# EAGLE schematic M7102 (EAGLE 6.6.0)

## Sheet 1 of 10
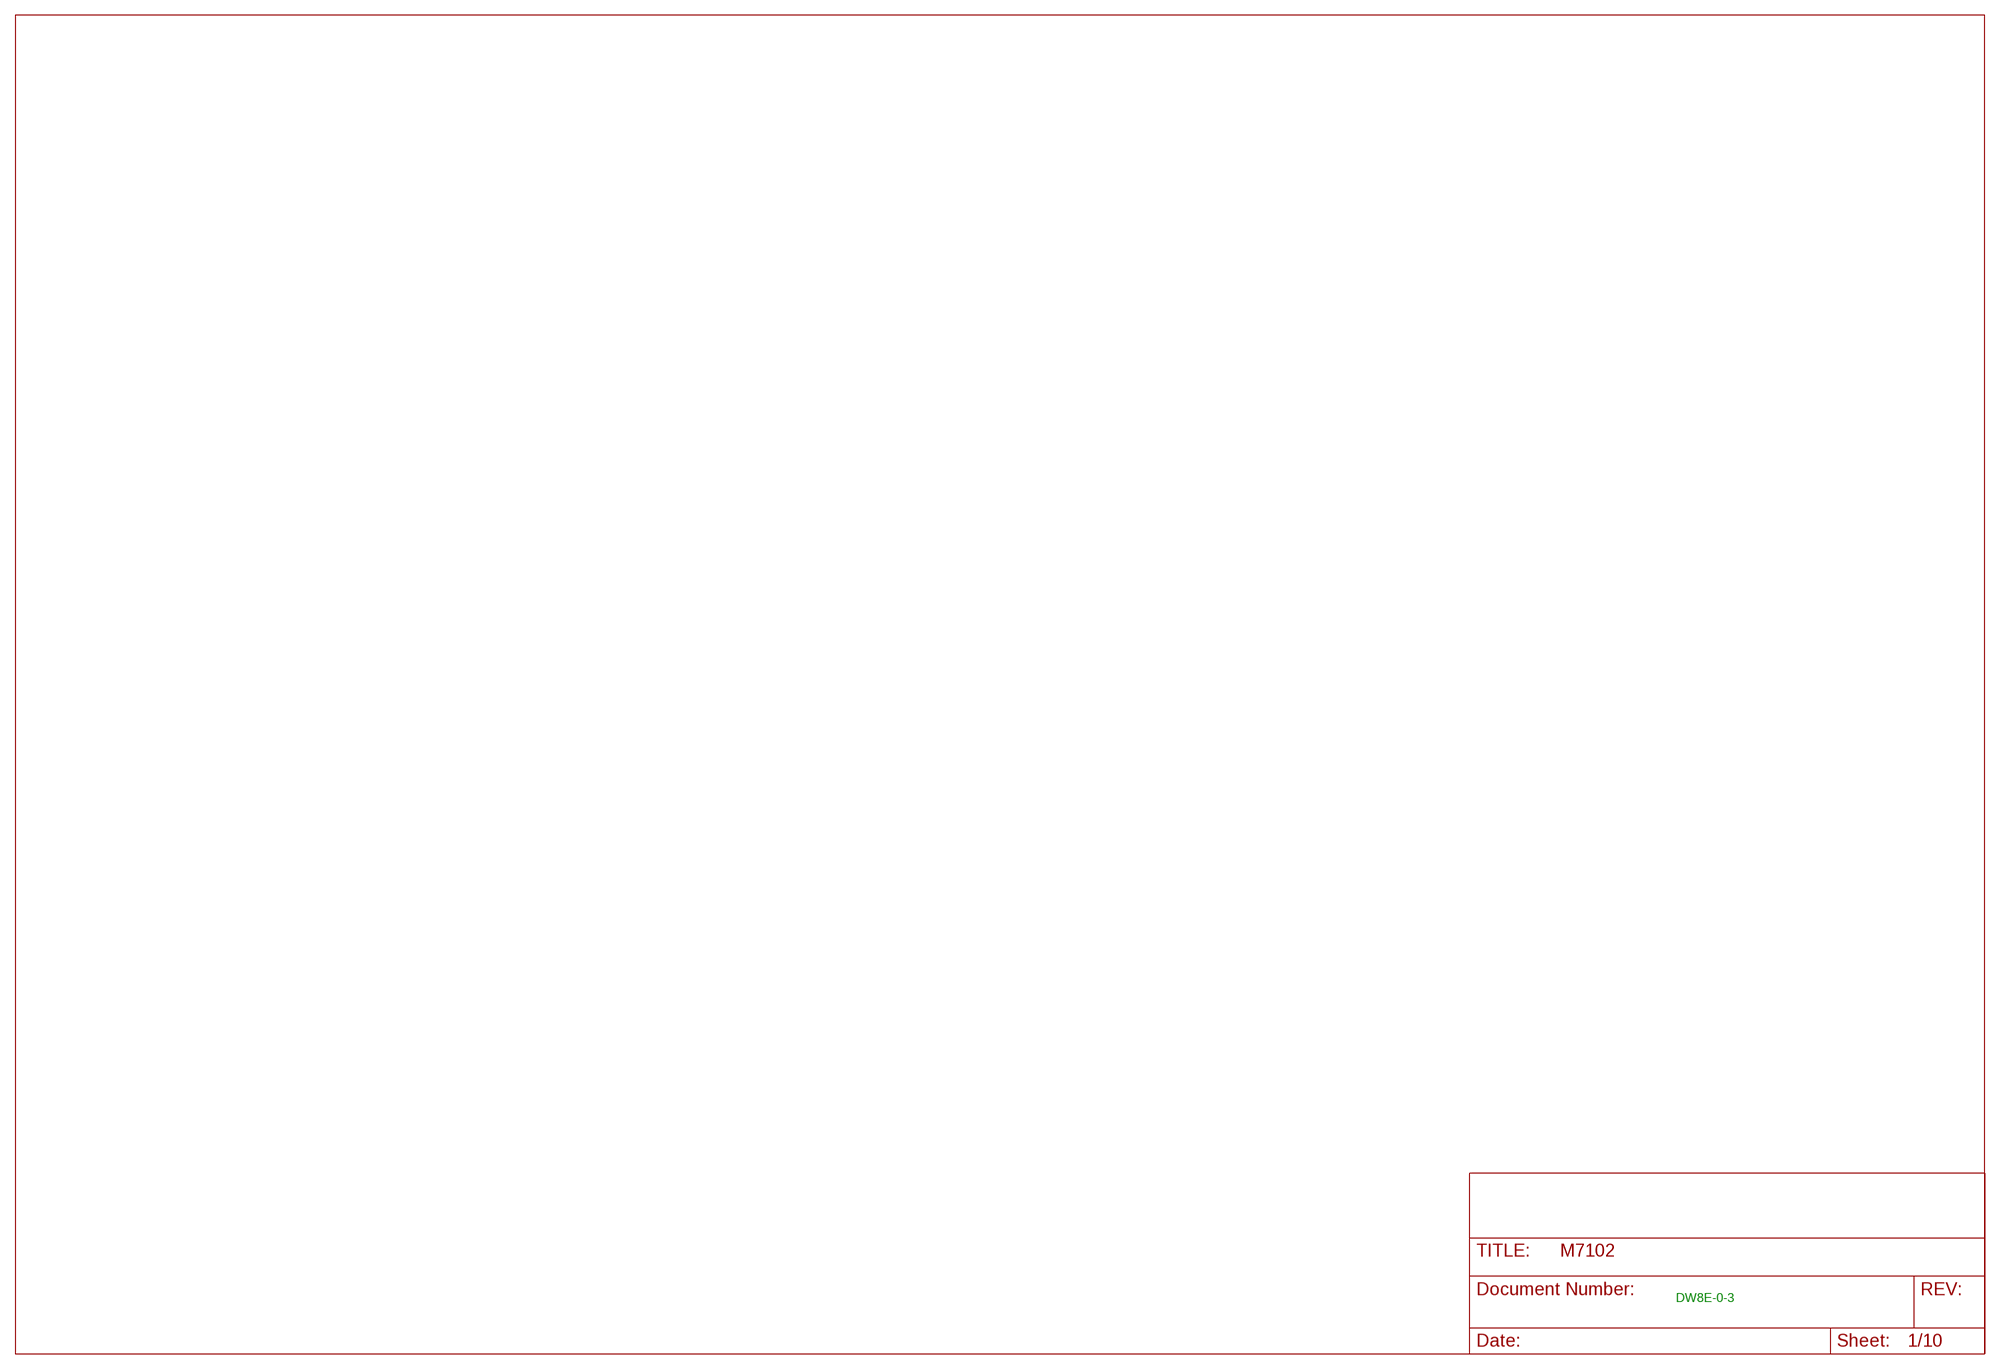
[diagram p0: schematic, sheet 1]

### Notes on the sheet
- DW8E-0-3

## Sheet 2 of 10
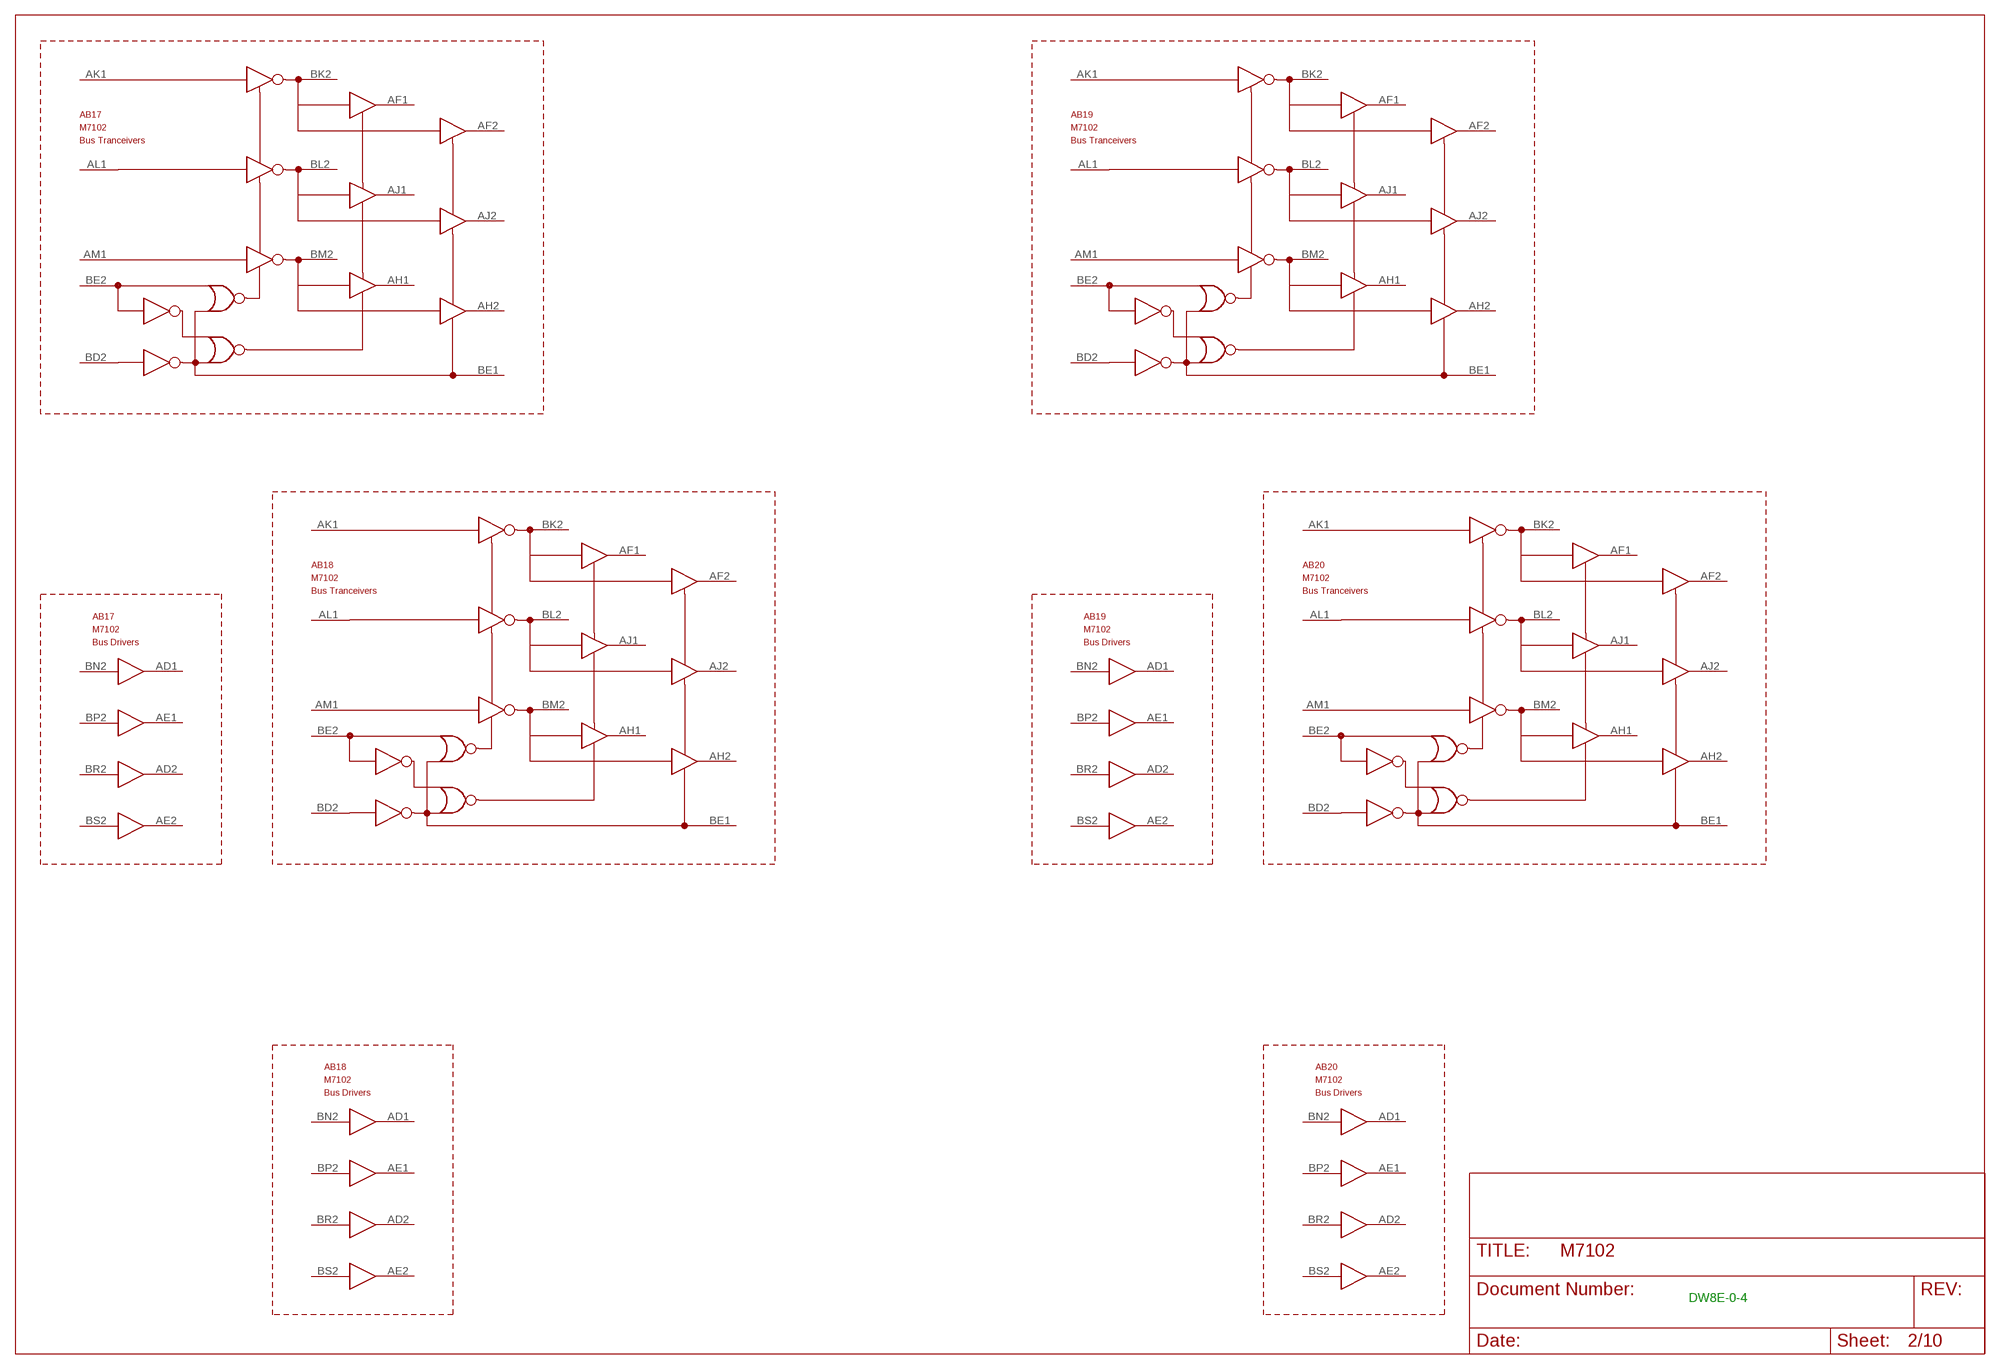
[diagram p1: schematic, sheet 2]

### Parts
AB17  M7102  [H807-2]
AB18  M7102  [H807-2]
AB19  M7102  [H807-2]
AB20  M7102  [H807-2]
Unconnected: AB17.AA1 AB17.AB1 AB17.AD1 AB17.AD2 AB17.AE1 AB17.AE2 AB17.AF1 AB17.AF2 AB17.AH1 AB17.AH2 AB17.AJ1 AB17.AJ2 AB17.AK1 AB17.AL1 AB17.AM1 AB17.AU1 AB17.AV1 AB17.BC1 AB17.BD1 AB17.BD2 AB17.BE1 AB17.BE2 AB17.BK2 AB17.BL2 AB17.BM2 AB17.BN2 AB17.BP2 AB17.BR2 AB17.BS2 AB17.BU1 AB17.BU2 AB17.BV1 AB17.BV2 AB18.AA1 AB18.AB1 AB18.AD1 AB18.AD2 AB18.AE1 AB18.AE2 AB18.AF1 AB18.AF2 AB18.AH1 AB18.AH2 AB18.AJ1 AB18.AJ2 AB18.AK1 AB18.AL1 AB18.AM1 AB18.AU1 AB18.AV1 AB18.BC1 AB18.BD1 AB18.BD2 AB18.BE1 AB18.BE2 AB18.BK2 AB18.BL2 AB18.BM2 AB18.BN2 AB18.BP2 AB18.BR2 AB18.BS2 AB18.BU1 AB18.BU2 AB18.BV1 AB18.BV2 AB19.AA1 AB19.AB1 AB19.AD1 AB19.AD2 AB19.AE1 AB19.AE2 AB19.AF1 AB19.AF2 AB19.AH1 AB19.AH2 AB19.AJ1 AB19.AJ2 AB19.AK1 AB19.AL1 AB19.AM1 AB19.AU1 AB19.AV1 AB19.BC1 AB19.BD1 AB19.BD2 AB19.BE1 AB19.BE2 AB19.BK2 AB19.BL2 AB19.BM2 AB19.BN2 AB19.BP2 AB19.BR2 AB19.BS2 AB19.BU1 AB19.BU2 AB19.BV1 AB19.BV2 AB20.AA1 AB20.AB1 AB20.AD1 AB20.AD2 AB20.AE1 AB20.AE2 AB20.AF1 AB20.AF2 AB20.AH1 AB20.AH2 AB20.AJ1 AB20.AJ2 AB20.AK1 AB20.AL1 AB20.AM1 AB20.AU1 AB20.AV1 AB20.BC1 AB20.BD1 AB20.BD2 AB20.BE1 AB20.BE2 AB20.BK2 AB20.BL2 AB20.BM2 AB20.BN2 AB20.BP2 AB20.BR2 AB20.BS2 AB20.BU1 AB20.BU2 AB20.BV1 AB20.BV2

### Notes on the sheet
- DW8E-0-4

## Sheet 3 of 10
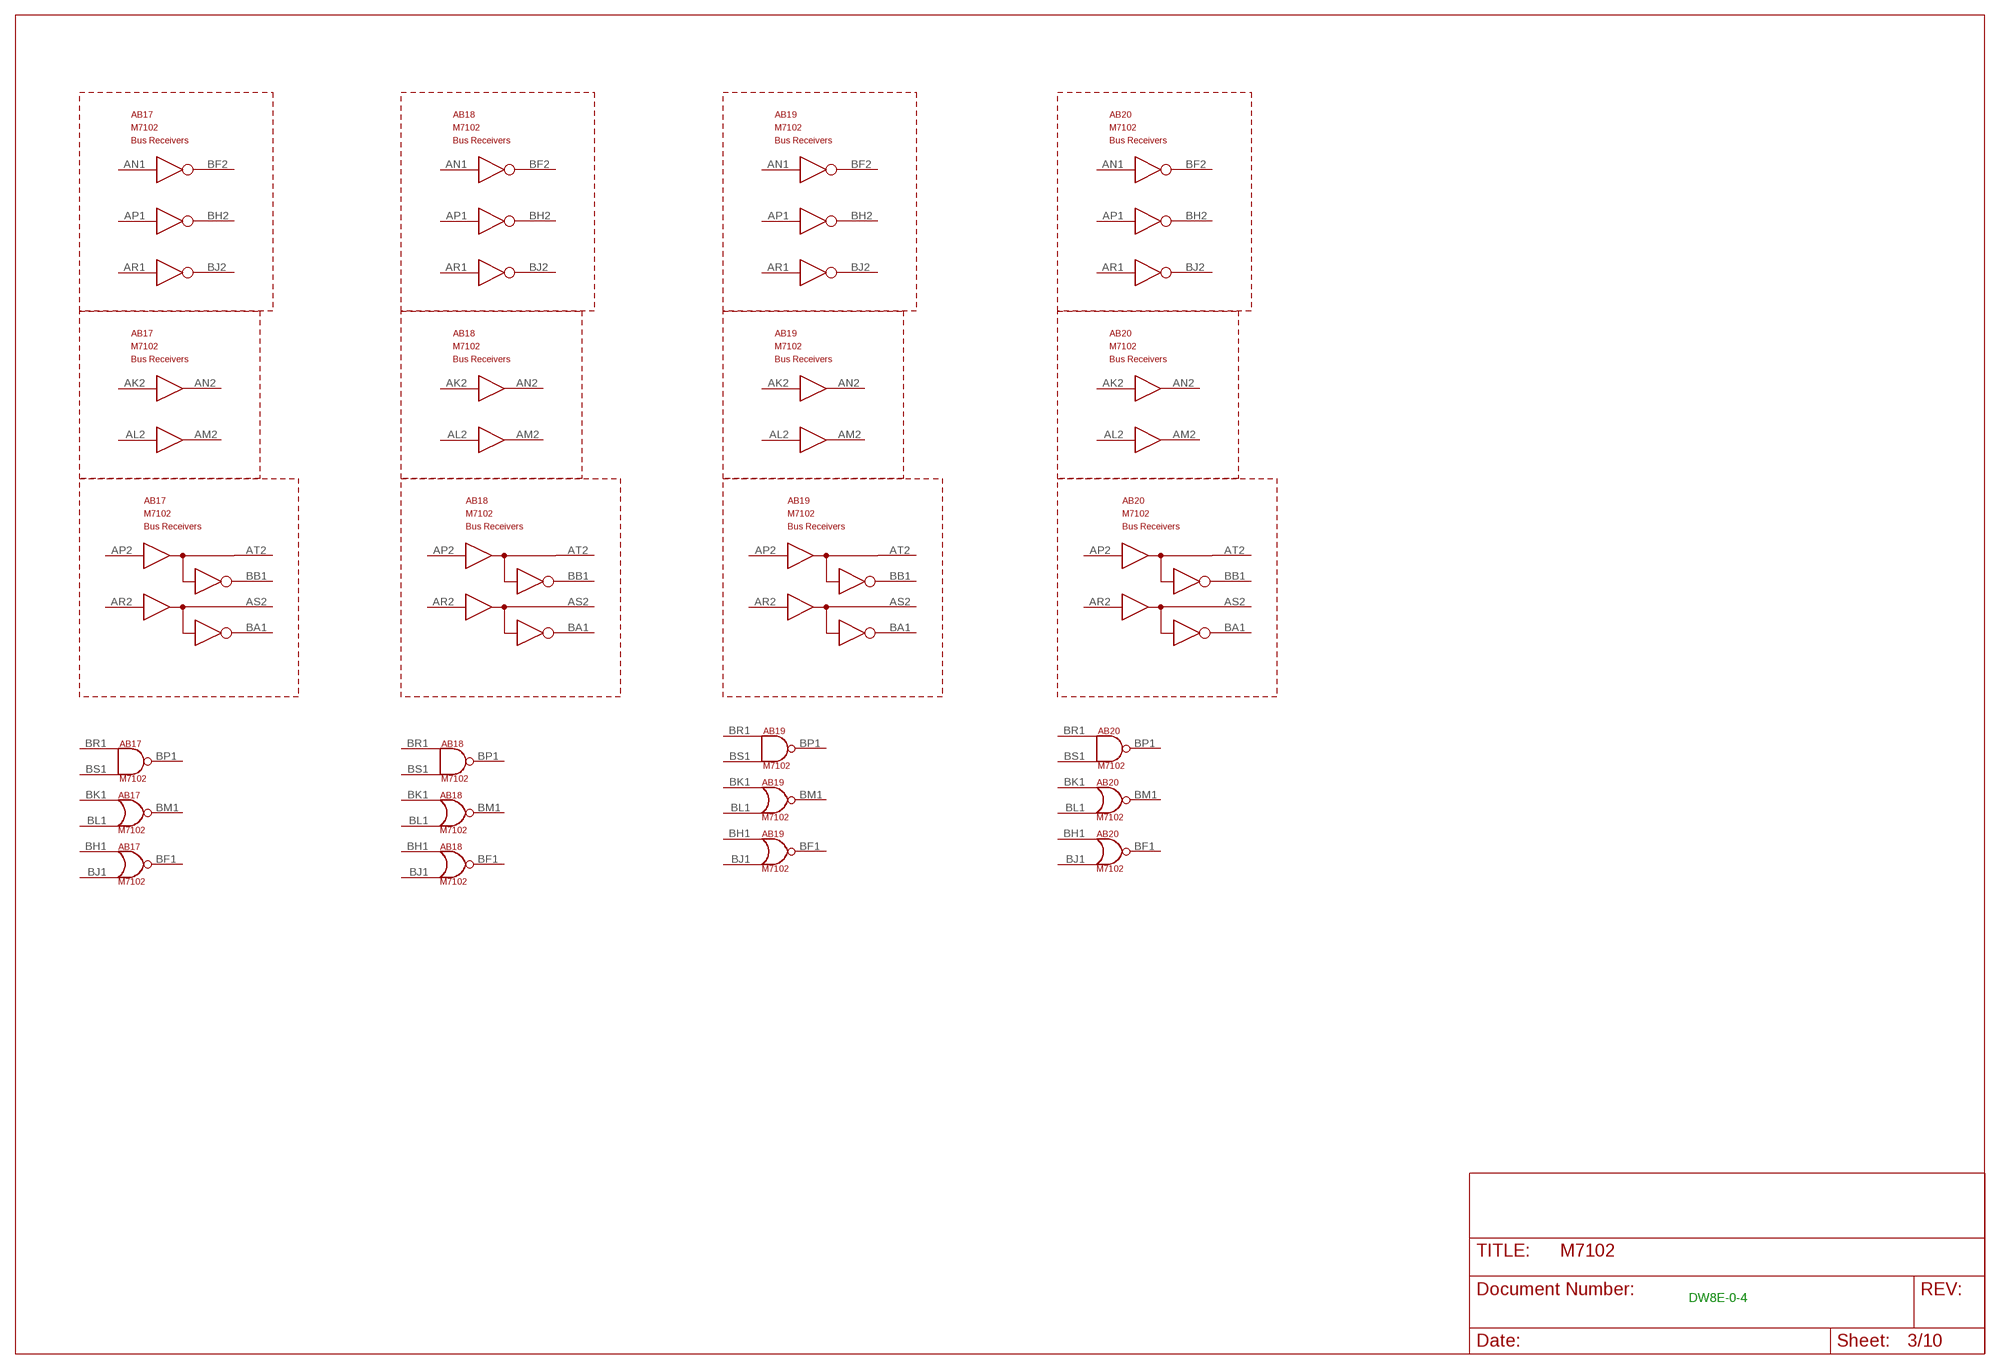
[diagram p2: schematic, sheet 3]
Unconnected: AB17.AK2 AB17.AL2 AB17.AM2 AB17.AN1 AB17.AN2 AB17.AP1 AB17.AP2 AB17.AR1 AB17.AR2 AB17.AS2 AB17.AT2 AB17.BA1 AB17.BB1 AB17.BF1(NOR2:OUT) AB17.BF2 AB17.BH1(NOR2:IN1) AB17.BH2 AB17.BJ1(NOR2:IN2) AB17.BJ2 AB17.BK1(NOR1:IN1) AB17.BL1(NOR1:IN2) AB17.BM1(NOR1:OUT) AB17.BP1(NAND:OUT) AB17.BR1(NAND:IN1) AB17.BS1(NAND:IN2) AB18.AK2 AB18.AL2 AB18.AM2 AB18.AN1 AB18.AN2 AB18.AP1 AB18.AP2 AB18.AR1 AB18.AR2 AB18.AS2 AB18.AT2 AB18.BA1 AB18.BB1 AB18.BF1(NOR2:OUT) AB18.BF2 AB18.BH1(NOR2:IN1) AB18.BH2 AB18.BJ1(NOR2:IN2) AB18.BJ2 AB18.BK1(NOR1:IN1) AB18.BL1(NOR1:IN2) AB18.BM1(NOR1:OUT) AB18.BP1(NAND:OUT) AB18.BR1(NAND:IN1) AB18.BS1(NAND:IN2) AB19.AK2 AB19.AL2 AB19.AM2 AB19.AN1 AB19.AN2 AB19.AP1 AB19.AP2 AB19.AR1 AB19.AR2 AB19.AS2 AB19.AT2 AB19.BA1 AB19.BB1 AB19.BF1(NOR2:OUT) AB19.BF2 AB19.BH1(NOR2:IN1) AB19.BH2 AB19.BJ1(NOR2:IN2) AB19.BJ2 AB19.BK1(NOR1:IN1) AB19.BL1(NOR1:IN2) AB19.BM1(NOR1:OUT) AB19.BP1(NAND:OUT) AB19.BR1(NAND:IN1) AB19.BS1(NAND:IN2) AB20.AK2 AB20.AL2 AB20.AM2 AB20.AN1 AB20.AN2 AB20.AP1 AB20.AP2 AB20.AR1 AB20.AR2 AB20.AS2 AB20.AT2 AB20.BA1 AB20.BB1 AB20.BF1(NOR2:OUT) AB20.BF2 AB20.BH1(NOR2:IN1) AB20.BH2 AB20.BJ1(NOR2:IN2) AB20.BJ2 AB20.BK1(NOR1:IN1) AB20.BL1(NOR1:IN2) AB20.BM1(NOR1:OUT) AB20.BP1(NAND:OUT) AB20.BR1(NAND:IN1) AB20.BS1(NAND:IN2)

### Notes on the sheet
- DW8E-0-4

## Sheet 4 of 10
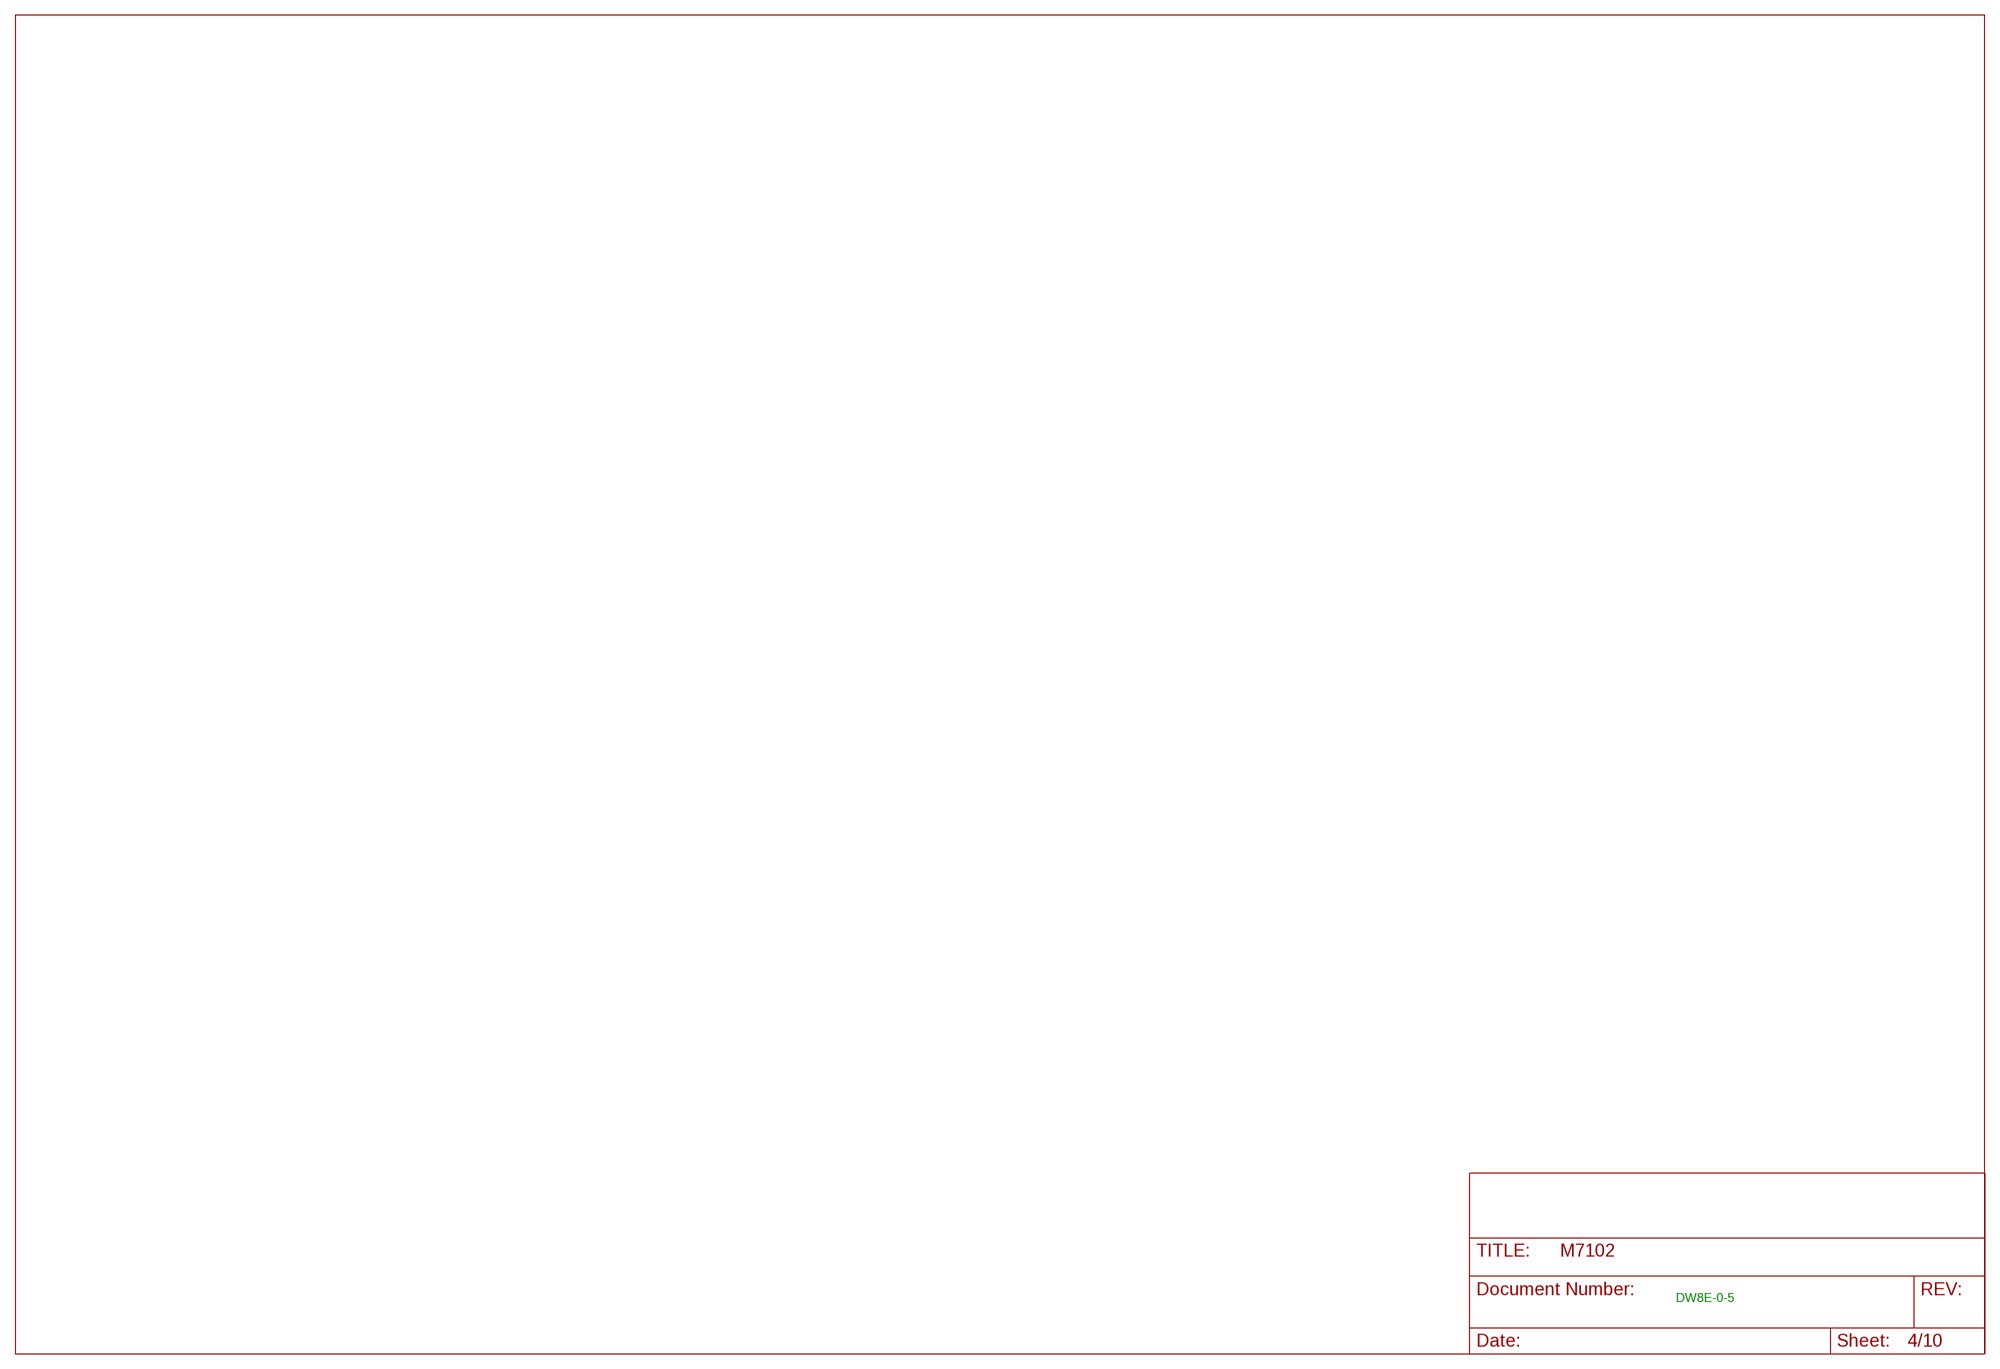
[diagram p3: schematic, sheet 4]

### Notes on the sheet
- DW8E-0-5

## Sheet 5 of 10
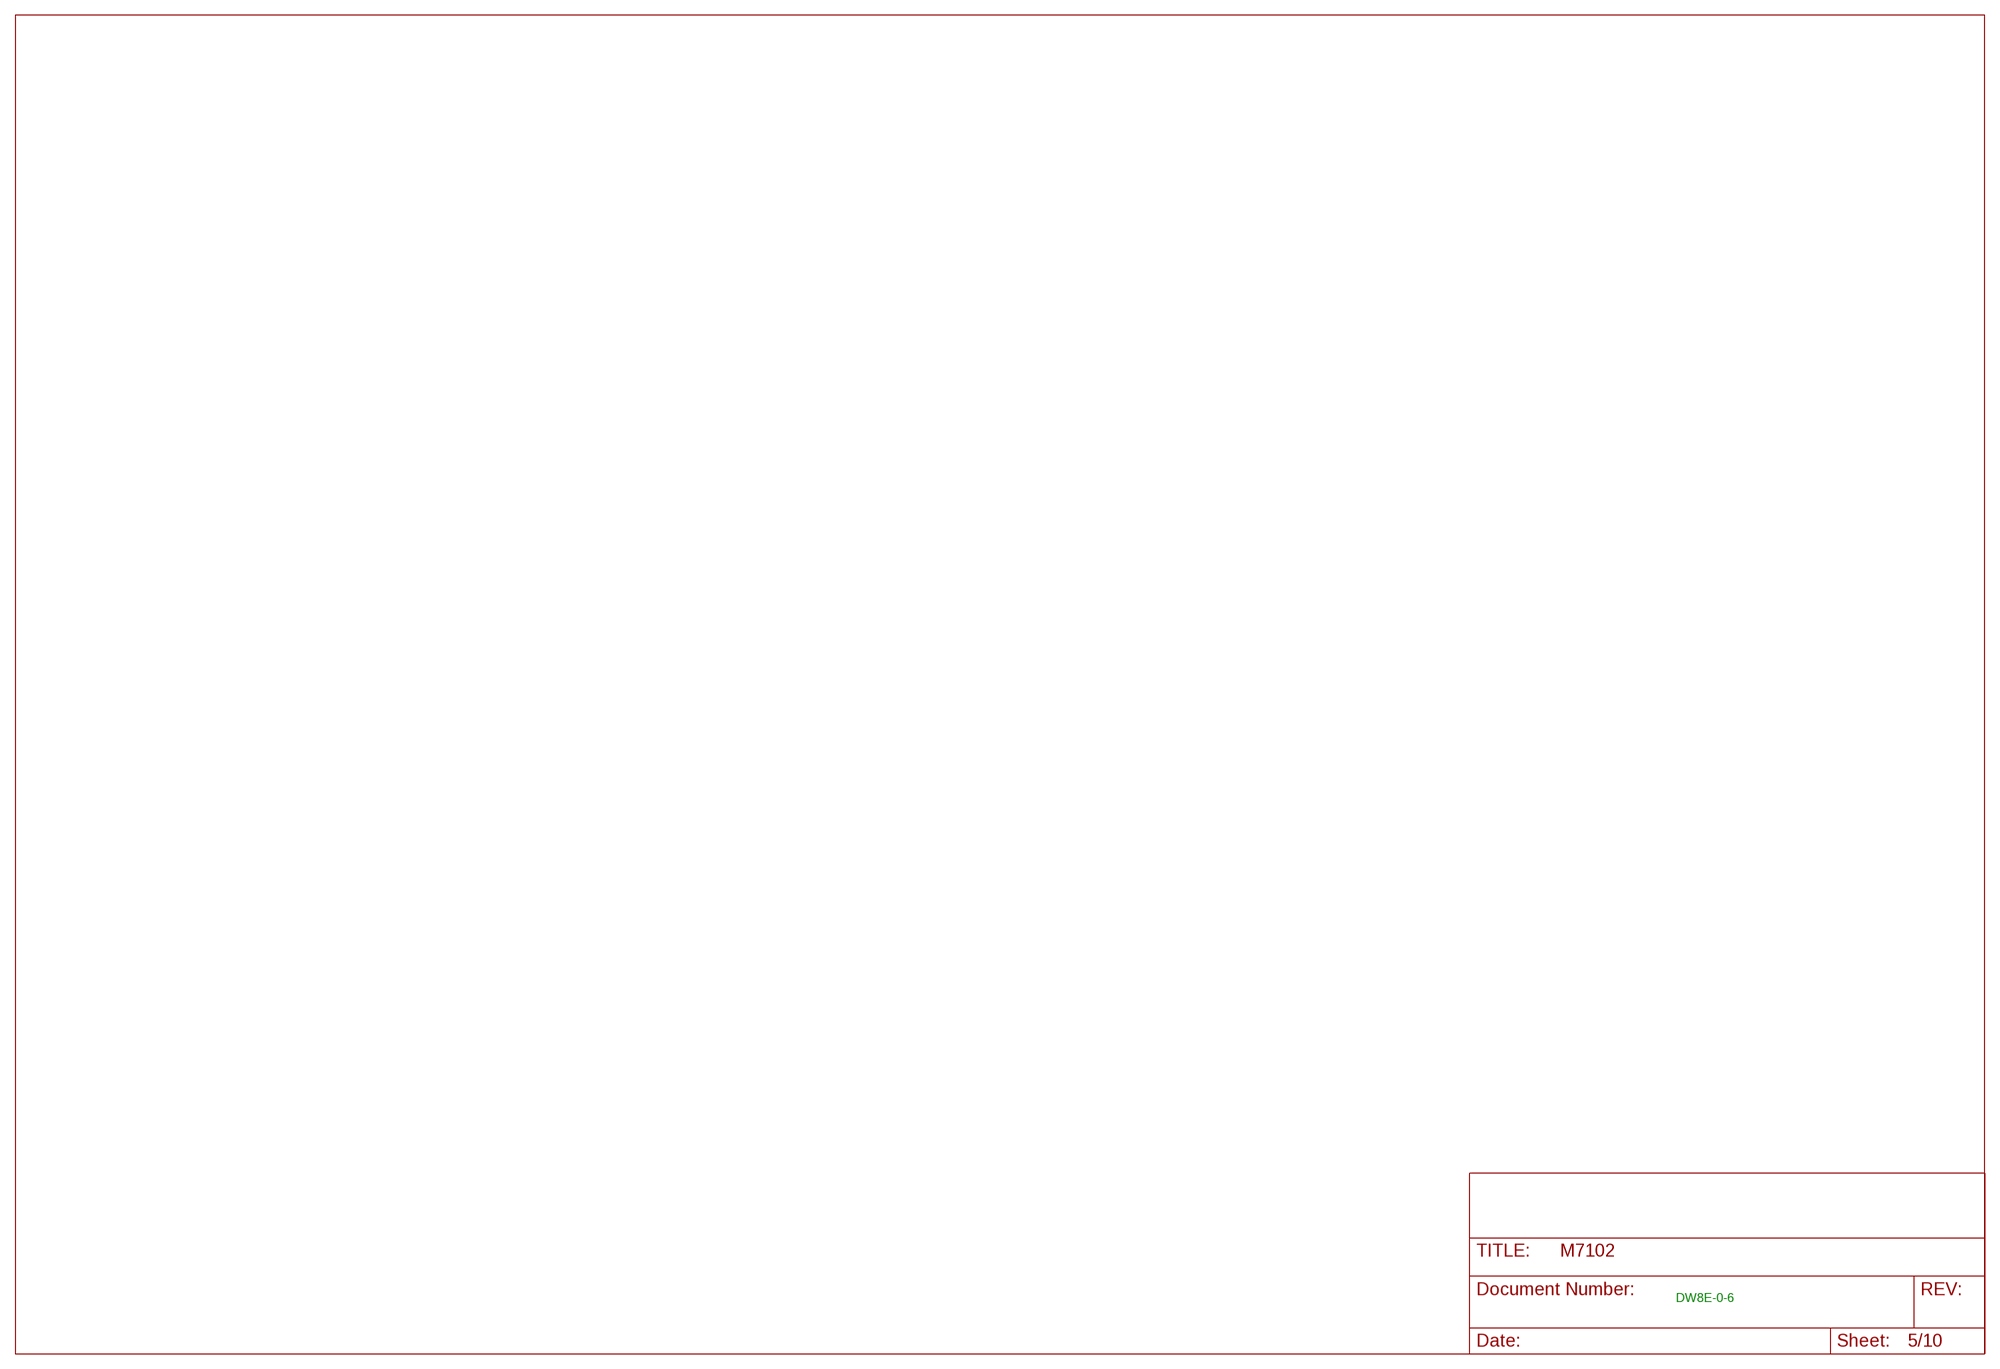
[diagram p4: schematic, sheet 5]

### Notes on the sheet
- DW8E-0-6

## Sheet 6 of 10
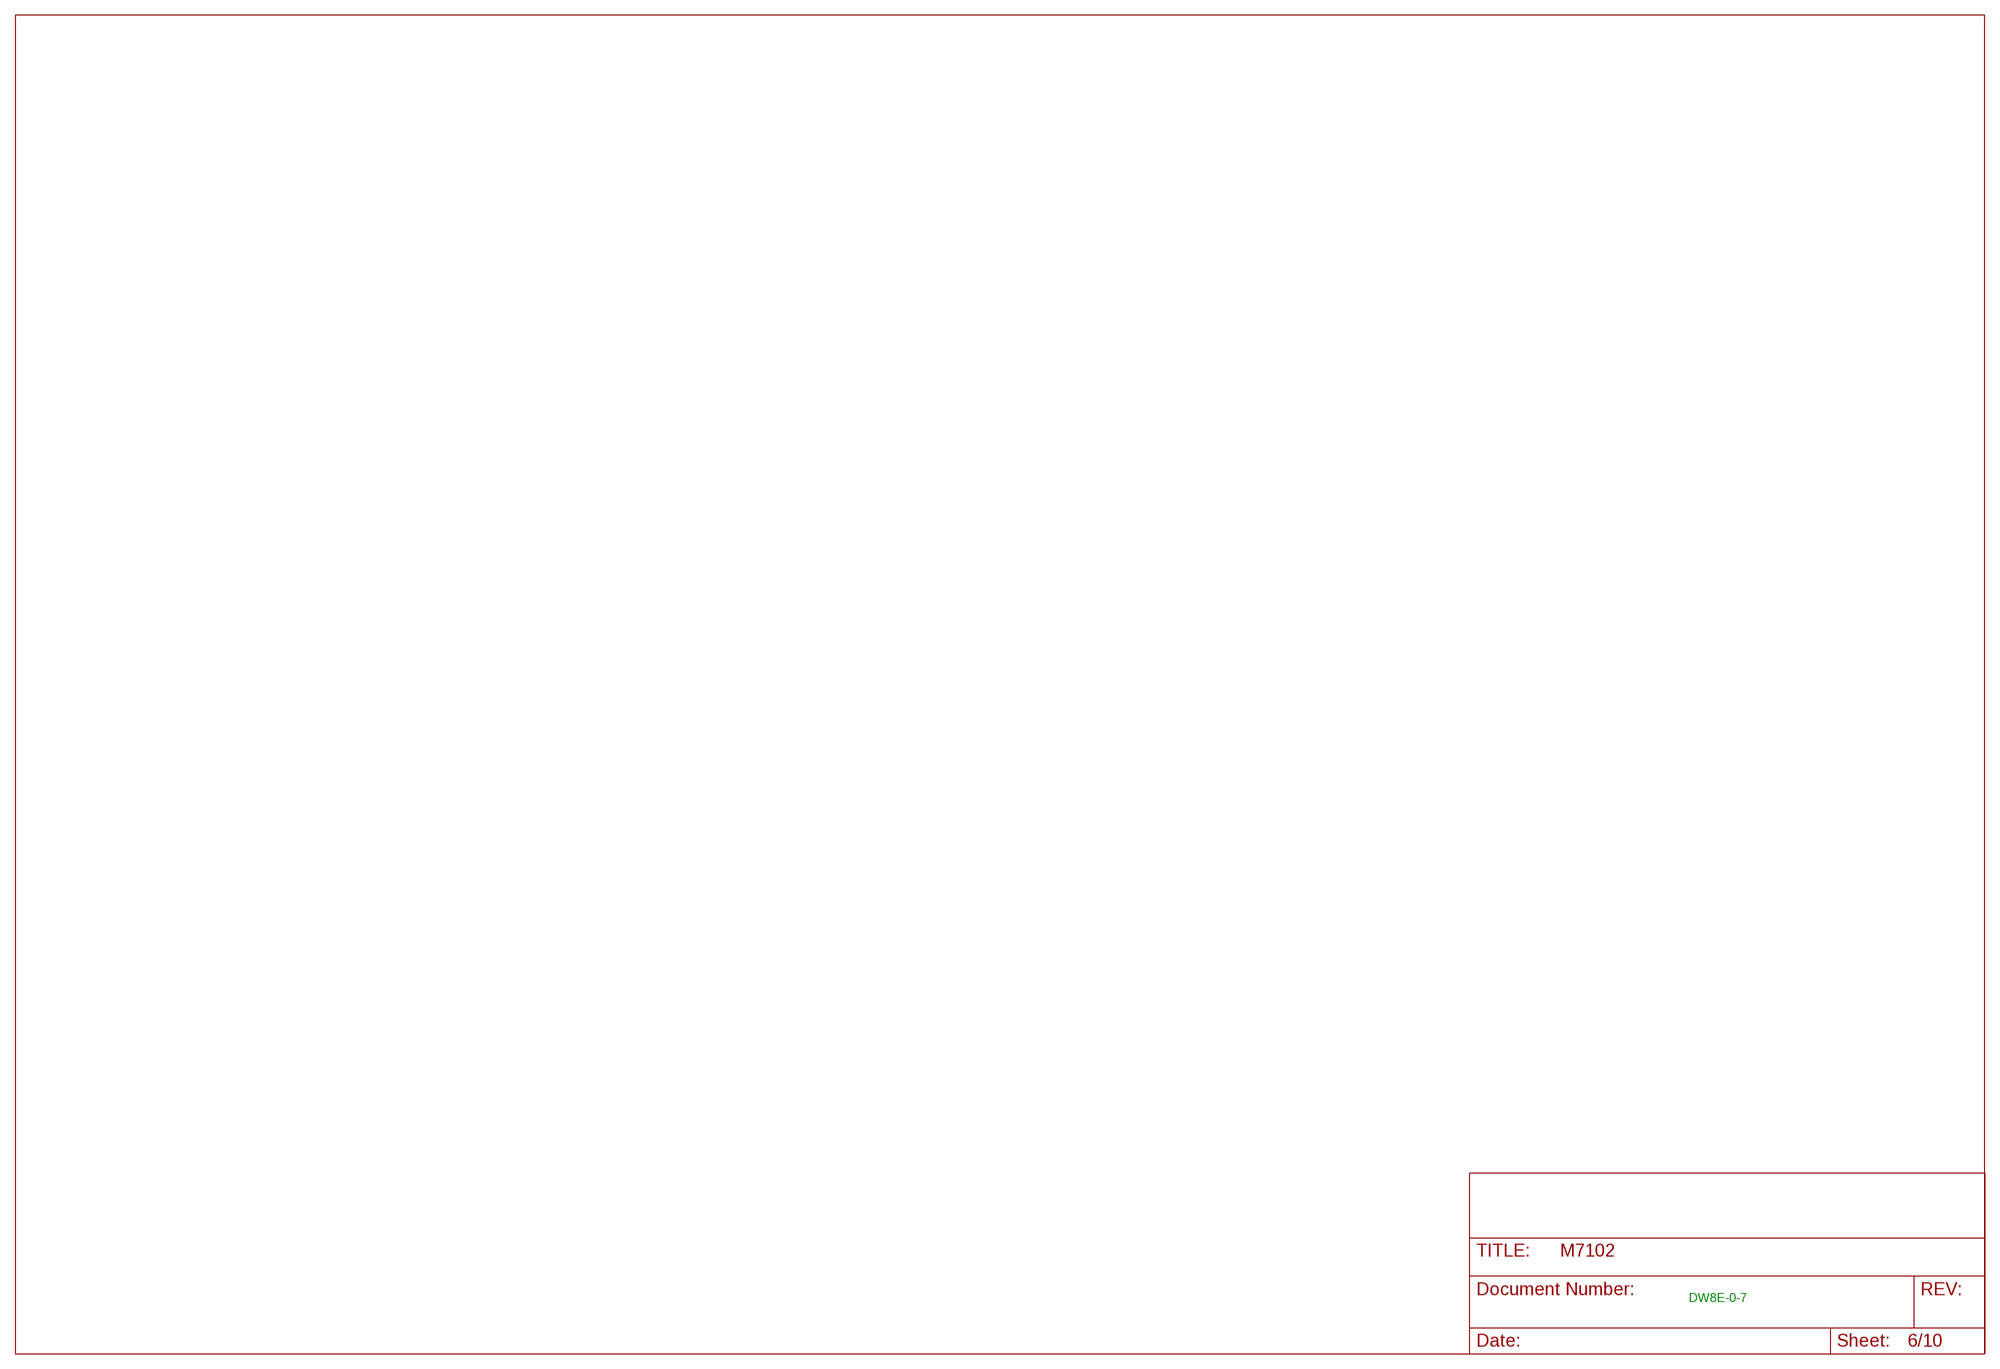
[diagram p5: schematic, sheet 6]

### Notes on the sheet
- DW8E-0-7

## Sheet 7 of 10
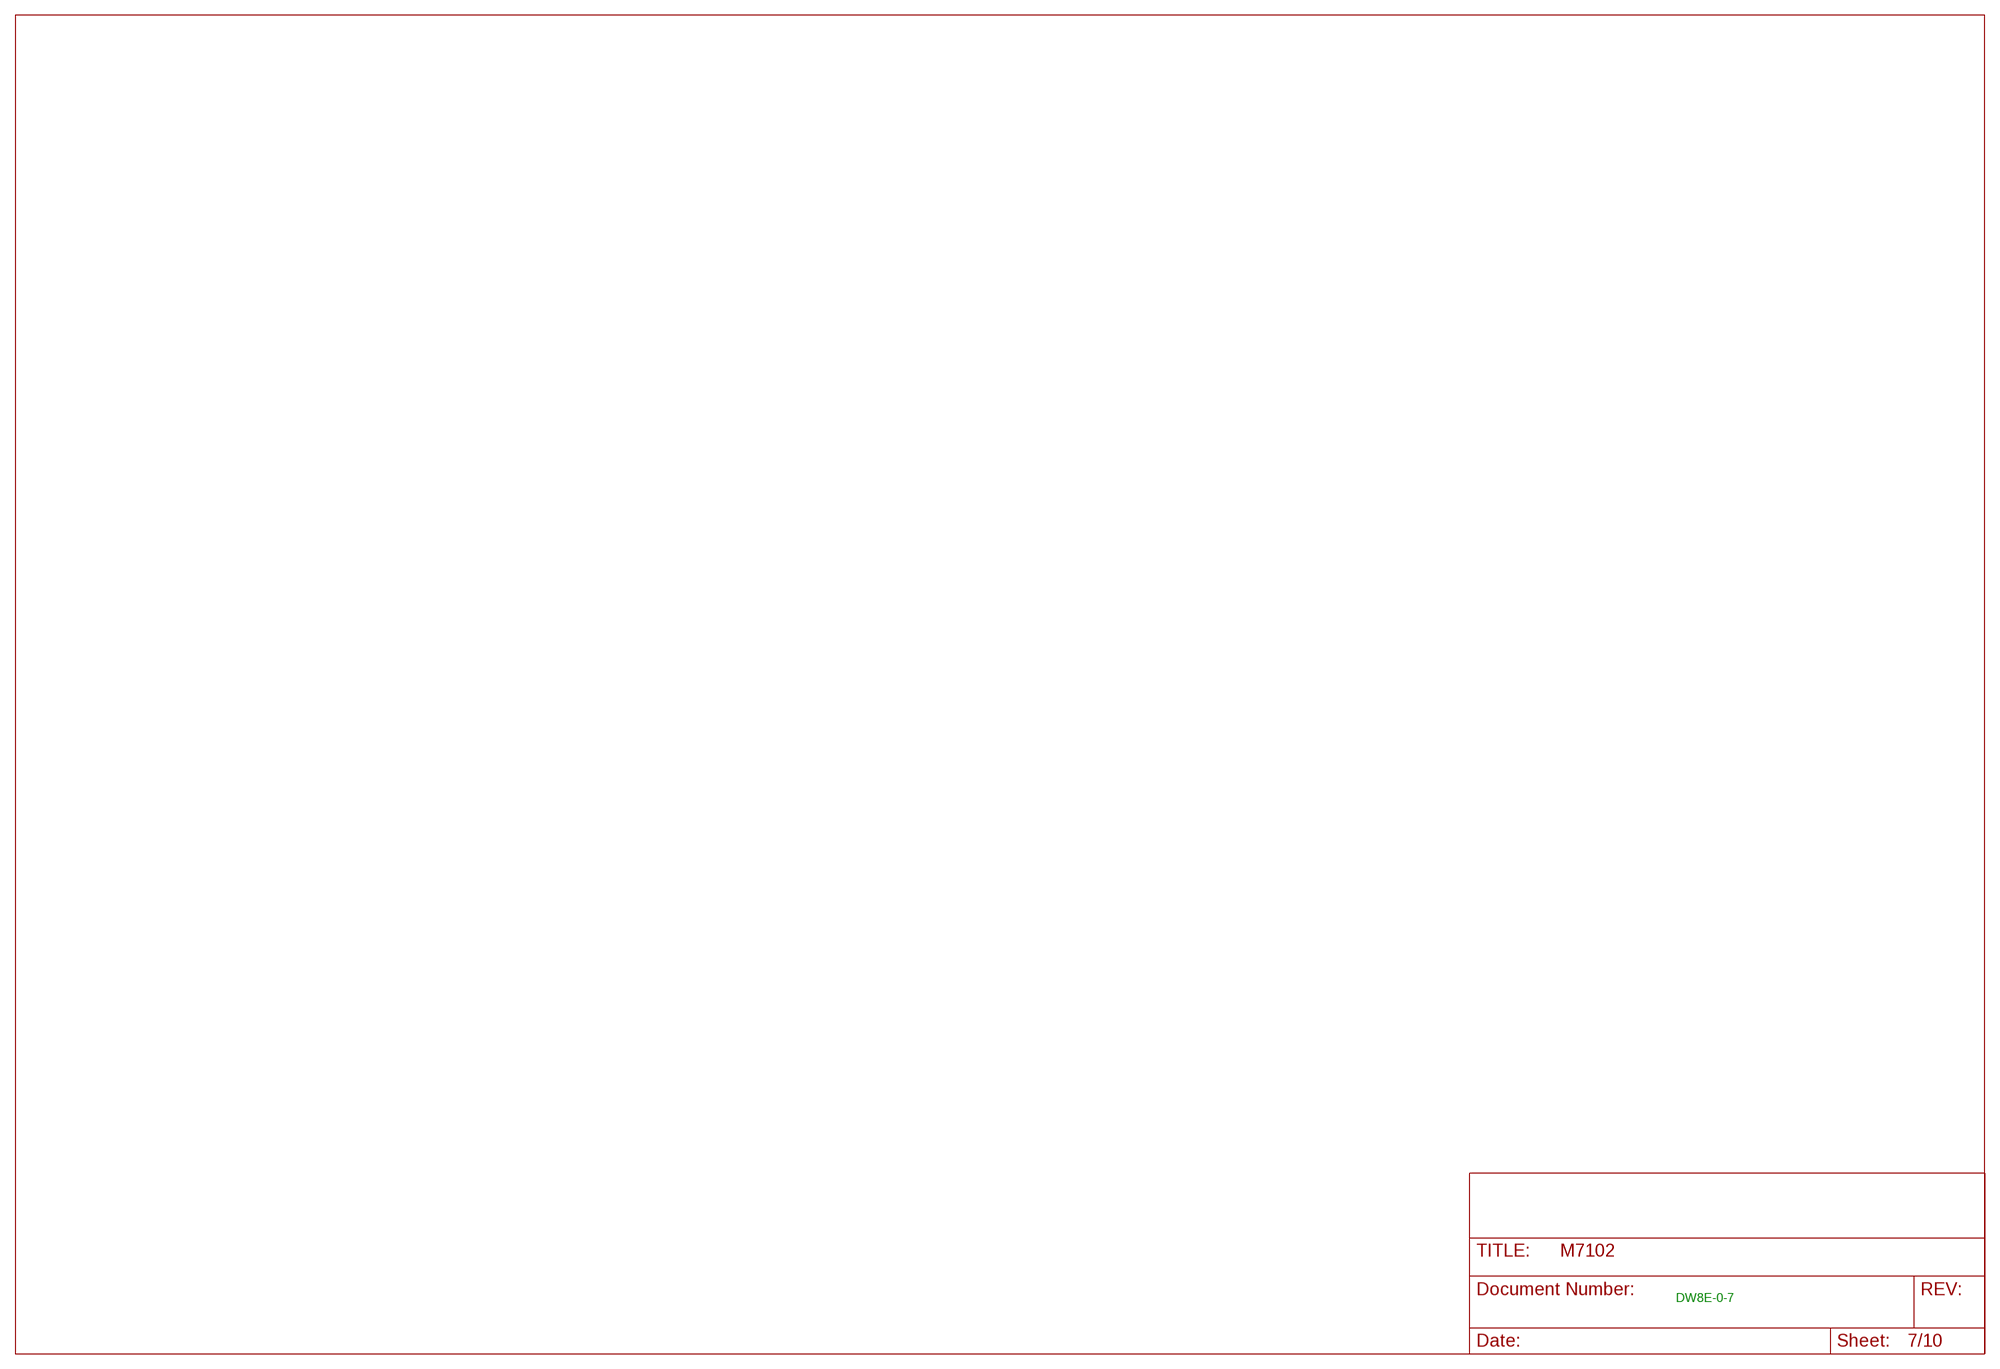
[diagram p6: schematic, sheet 7]

### Notes on the sheet
- DW8E-0-7

## Sheet 8 of 10
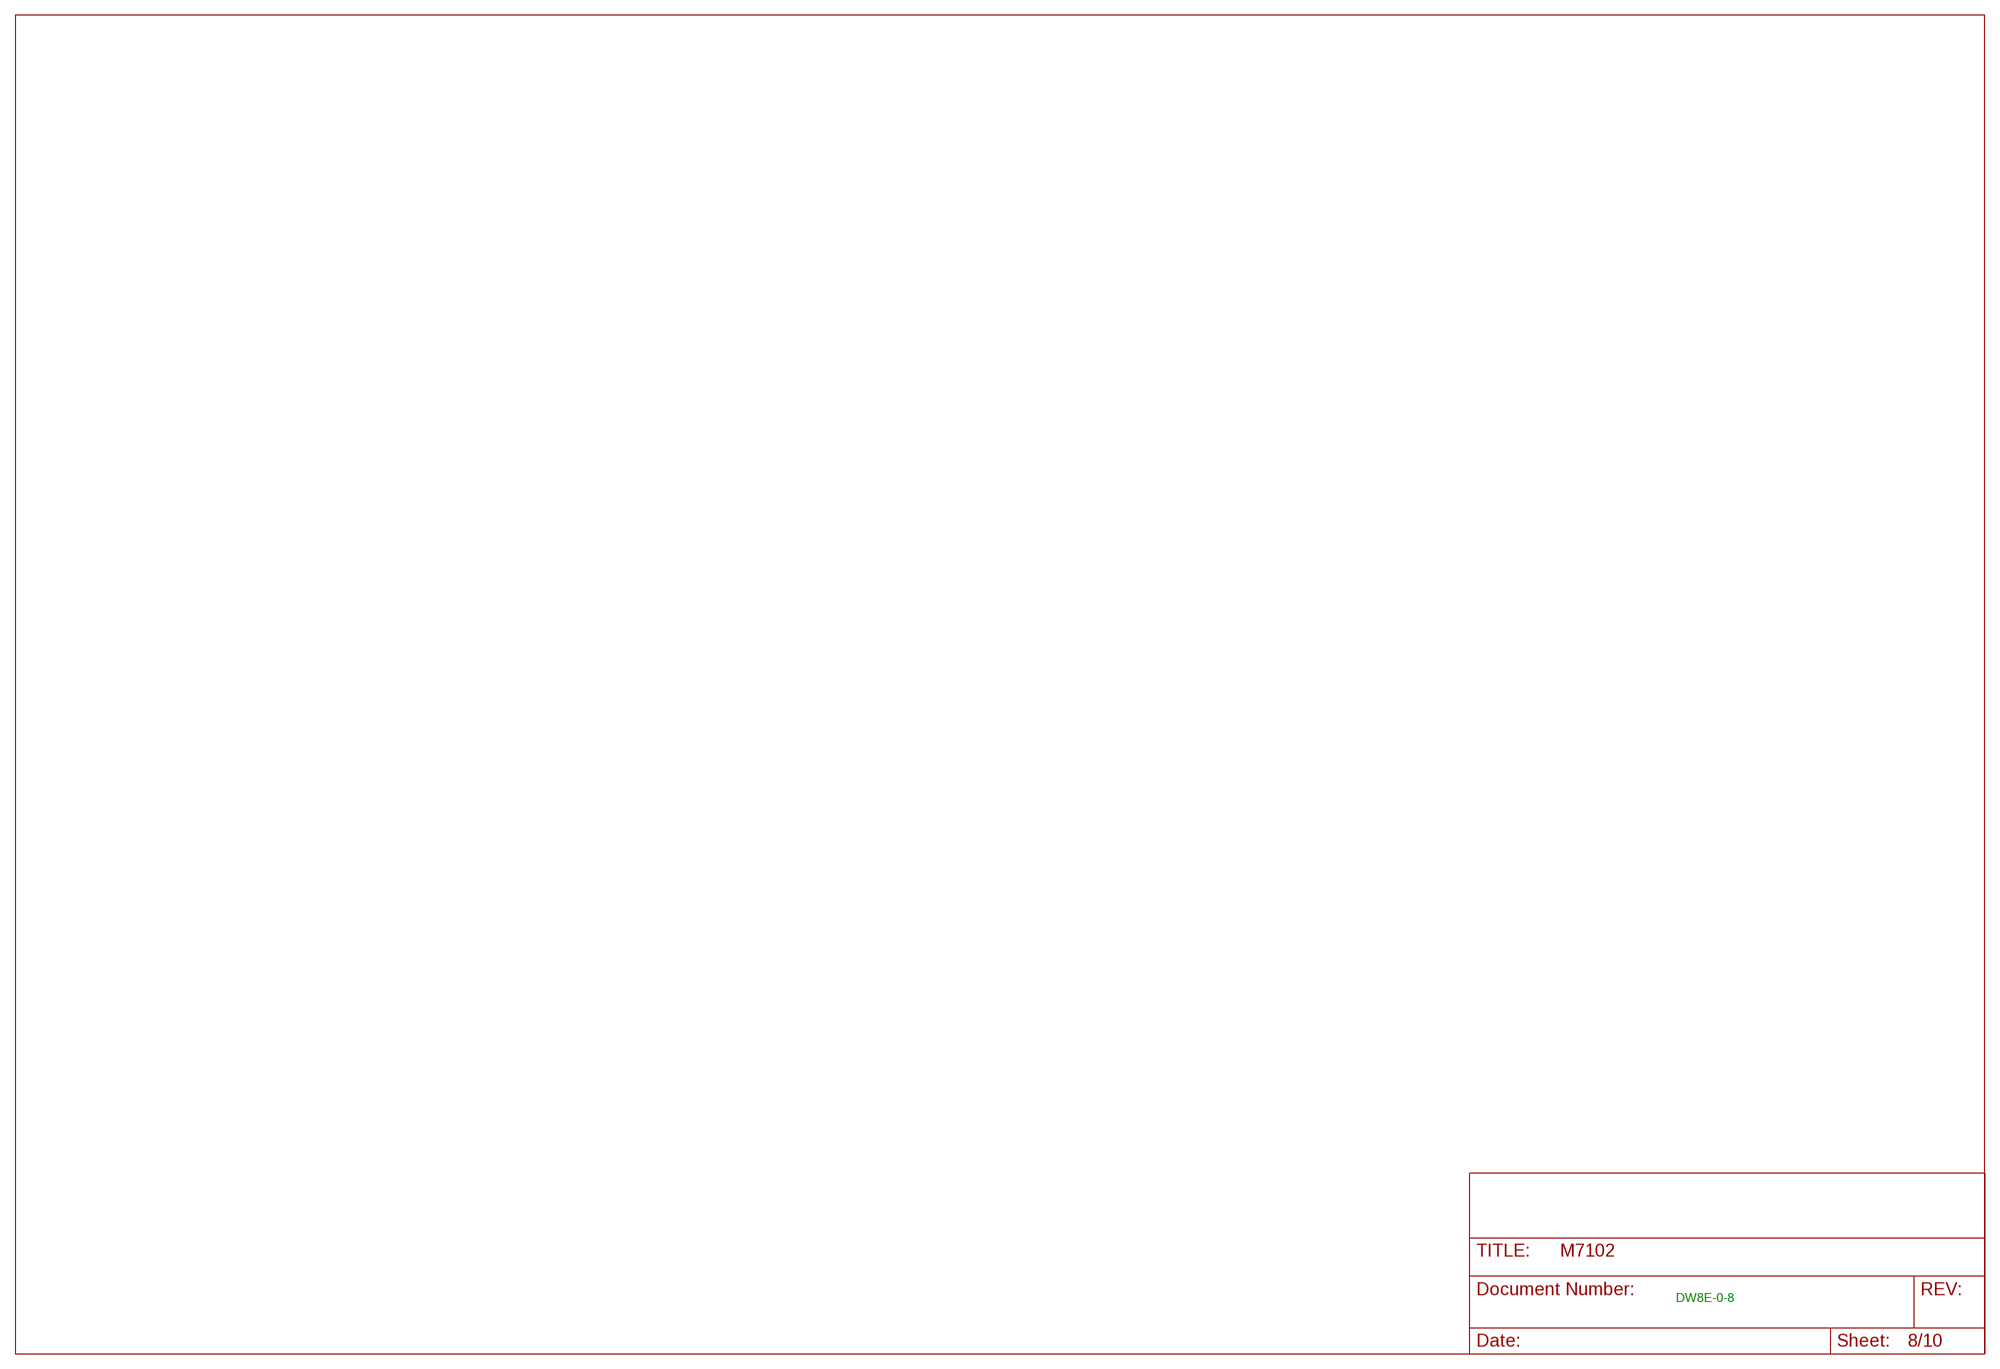
[diagram p7: schematic, sheet 8]

### Notes on the sheet
- DW8E-0-8

## Sheet 9 of 10
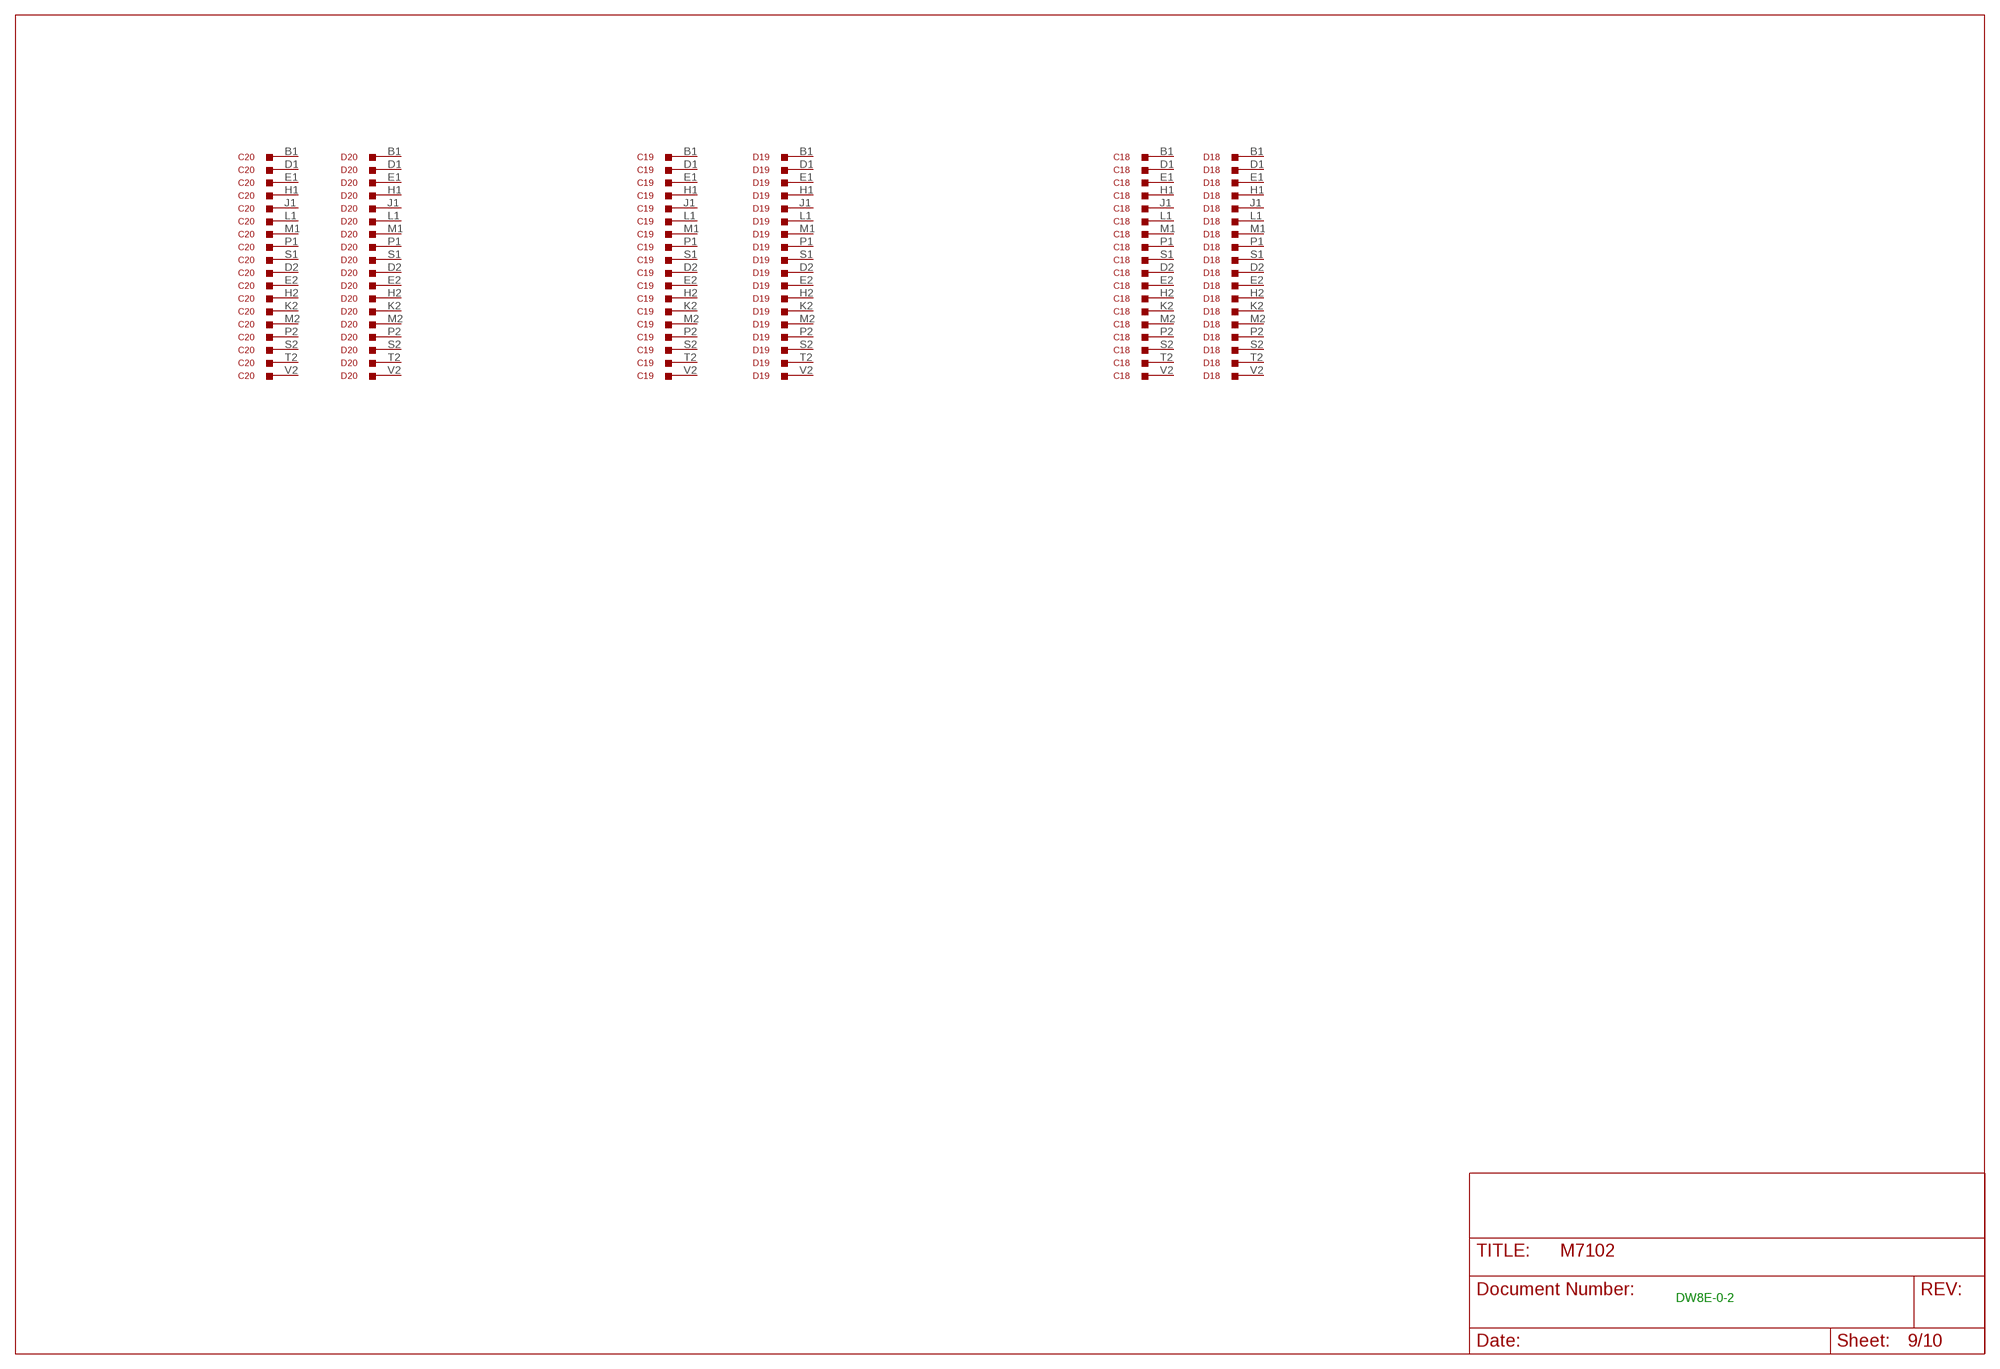
[diagram p8: schematic, sheet 9]

### Parts
C18  M903  [H807]
C19  M903  [H807]
C20  M903  [H807]
D18  M903  [H807]
D19  M903  [H807]
D20  M903  [H807]
Unconnected: C18.B1 C18.D1 C18.D2 C18.E1 C18.E2 C18.H1 C18.H2 C18.J1 C18.K2 C18.L1 C18.M1 C18.M2 C18.P1 C18.P2 C18.S1 C18.S2 C18.T2 C18.V2 C19.B1 C19.D1 C19.D2 C19.E1 C19.E2 C19.H1 C19.H2 C19.J1 C19.K2 C19.L1 C19.M1 C19.M2 C19.P1 C19.P2 C19.S1 C19.S2 C19.T2 C19.V2 C20.B1 C20.D1 C20.D2 C20.E1 C20.E2 C20.H1 C20.H2 C20.J1 C20.K2 C20.L1 C20.M1 C20.M2 C20.P1 C20.P2 C20.S1 C20.S2 C20.T2 C20.V2 D18.B1 D18.D1 D18.D2 D18.E1 D18.E2 D18.H1 D18.H2 D18.J1 D18.K2 D18.L1 D18.M1 D18.M2 D18.P1 D18.P2 D18.S1 D18.S2 D18.T2 D18.V2 D19.B1 D19.D1 D19.D2 D19.E1 D19.E2 D19.H1 D19.H2 D19.J1 D19.K2 D19.L1 D19.M1 D19.M2 D19.P1 D19.P2 D19.S1 D19.S2 D19.T2 D19.V2 D20.B1 D20.D1 D20.D2 D20.E1 D20.E2 D20.H1 D20.H2 D20.J1 D20.K2 D20.L1 D20.M1 D20.M2 D20.P1 D20.P2 D20.S1 D20.S2 D20.T2 D20.V2

### Notes on the sheet
- DW8E-0-2

## Sheet 10 of 10
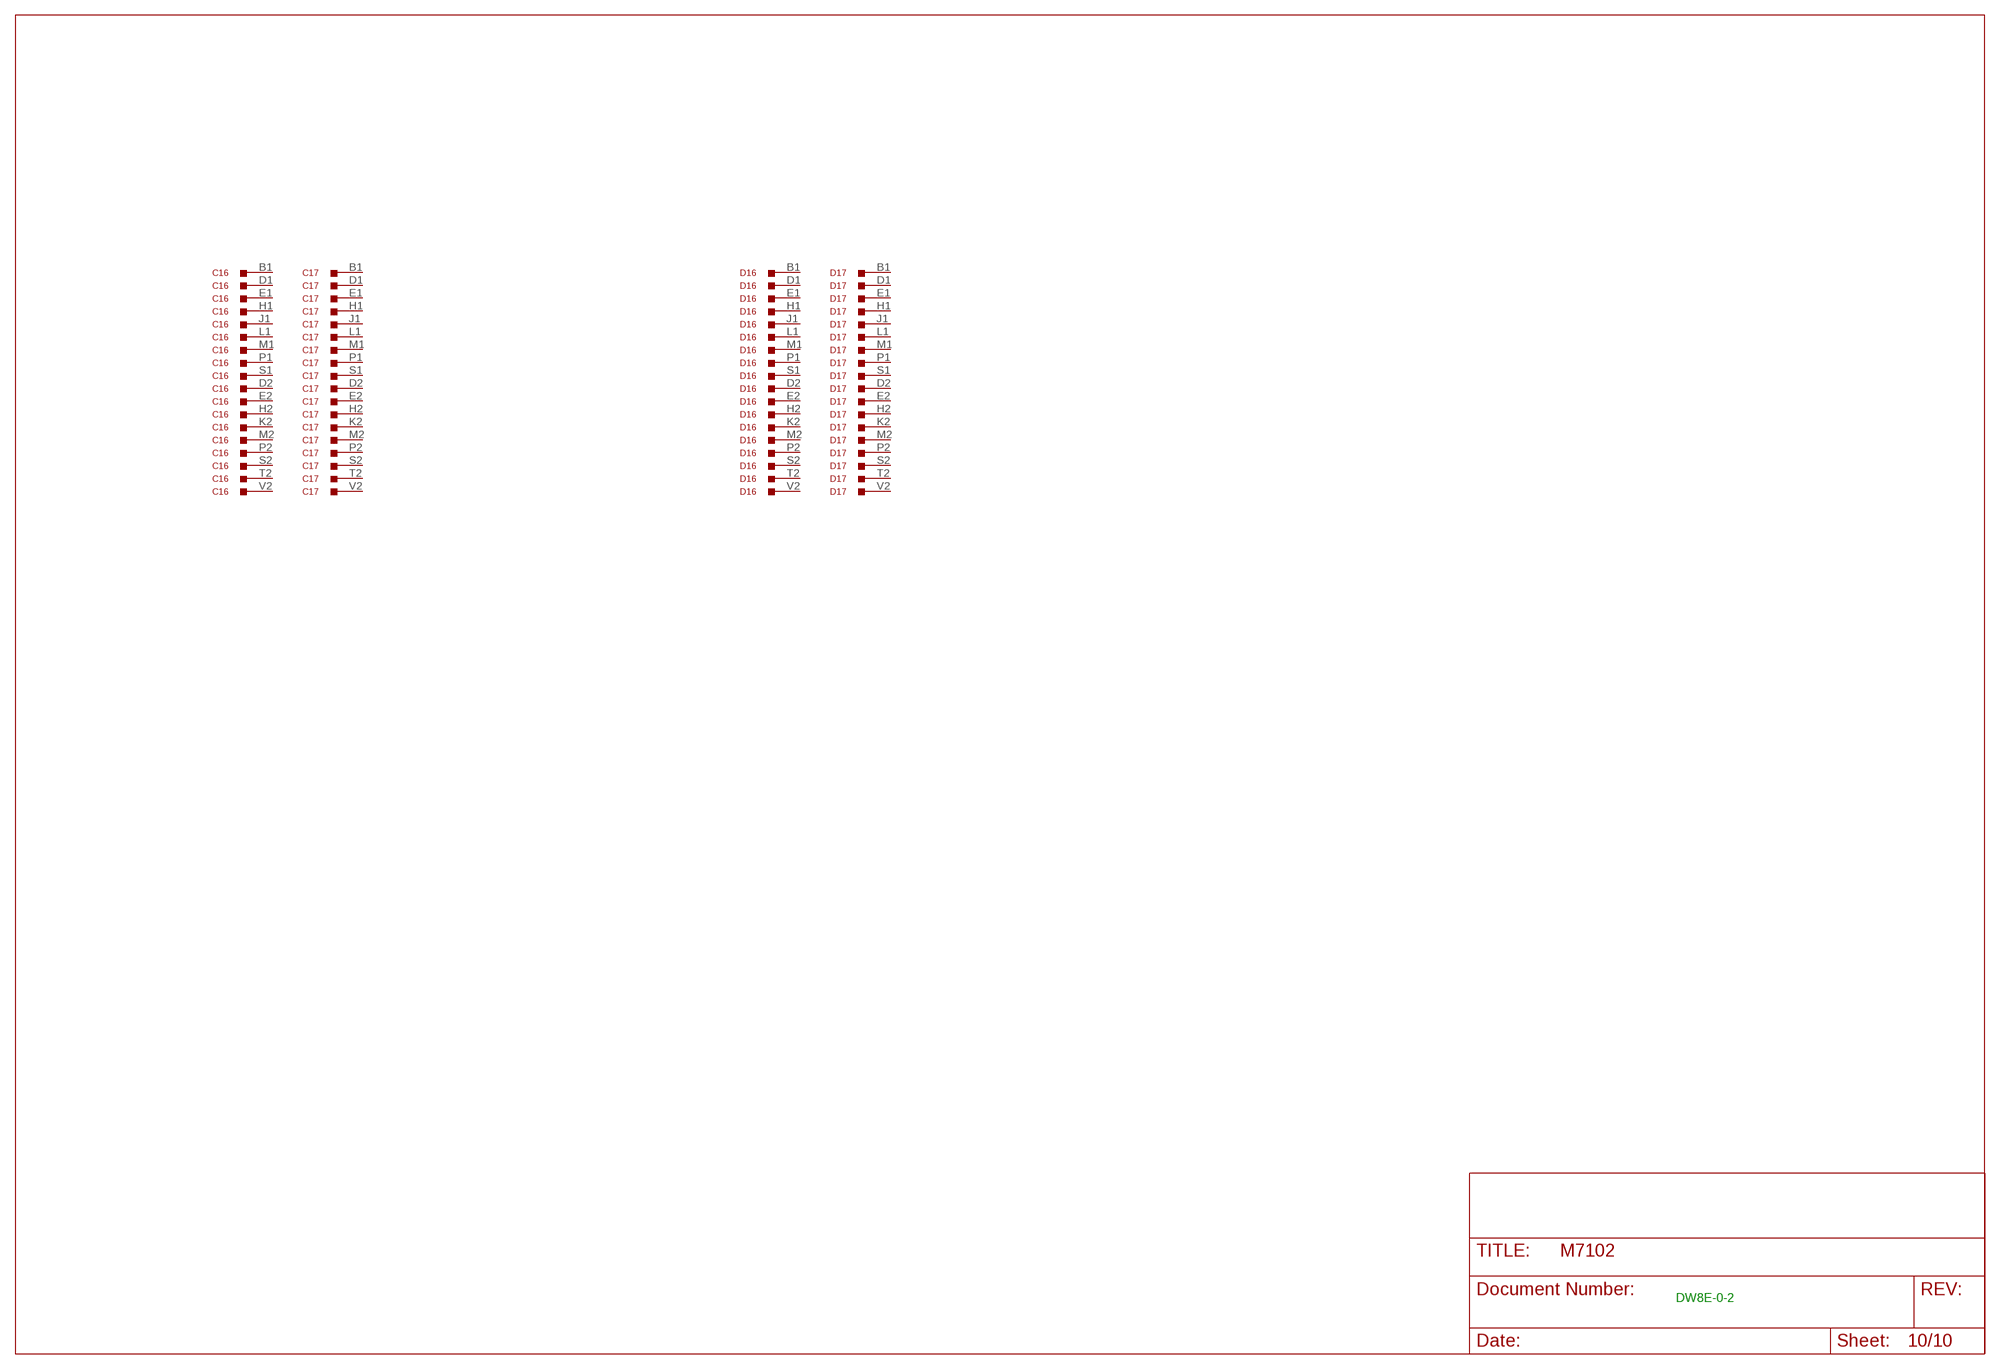
[diagram p9: schematic, sheet 10]

### Parts
C16  M903  [H807]
C17  M903  [H807]
D16  M903  [H807]
D17  M903  [H807]
Unconnected: C16.B1 C16.D1 C16.D2 C16.E1 C16.E2 C16.H1 C16.H2 C16.J1 C16.K2 C16.L1 C16.M1 C16.M2 C16.P1 C16.P2 C16.S1 C16.S2 C16.T2 C16.V2 C17.B1 C17.D1 C17.D2 C17.E1 C17.E2 C17.H1 C17.H2 C17.J1 C17.K2 C17.L1 C17.M1 C17.M2 C17.P1 C17.P2 C17.S1 C17.S2 C17.T2 C17.V2 D16.B1 D16.D1 D16.D2 D16.E1 D16.E2 D16.H1 D16.H2 D16.J1 D16.K2 D16.L1 D16.M1 D16.M2 D16.P1 D16.P2 D16.S1 D16.S2 D16.T2 D16.V2 D17.B1 D17.D1 D17.D2 D17.E1 D17.E2 D17.H1 D17.H2 D17.J1 D17.K2 D17.L1 D17.M1 D17.M2 D17.P1 D17.P2 D17.S1 D17.S2 D17.T2 D17.V2

### Notes on the sheet
- DW8E-0-2

## Power pins joined to a net without a drawn wire
-15V: AB17.AB2(-15V) AB17.BB2(-15V) AB18.AB2(-15V) AB18.BB2(-15V) AB19.AB2(-15V) AB19.BB2(-15V) AB20.AB2(-15V) AB20.BB2(-15V)
GND: AB17.AC2(GND) AB17.AT1(GND) AB17.BC2(GND) AB17.BT1(GND) AB18.AC2(GND) AB18.AT1(GND) AB18.BC2(GND) AB18.BT1(GND) AB19.AC2(GND) AB19.AT1(GND) AB19.BC2(GND) AB19.BT1(GND) AB20.AC2(GND) AB20.AT1(GND) AB20.BC2(GND) AB20.BT1(GND) C16.A1 C16.C1 C16.C2 C16.F1 C16.F2 C16.J2 C16.K1 C16.L2 C16.N1 C16.N2 C16.R1 C16.R2 C16.T1 C16.U2 C17.A1 C17.C1 C17.C2 C17.F1 C17.F2 C17.J2 C17.K1 C17.L2 C17.N1 C17.N2 C17.R1 C17.R2 C17.T1 C17.U2 C18.A1 C18.C1 C18.C2 C18.F1 C18.F2 C18.J2 C18.K1 C18.L2 C18.N1 C18.N2 C18.R1 C18.R2 C18.T1 C18.U2 C19.A1 C19.C1 C19.C2 C19.F1 C19.F2 C19.J2 C19.K1 C19.L2 C19.N1 C19.N2 C19.R1 C19.R2 C19.T1 C19.U2 C20.A1 C20.C1 C20.C2 C20.F1 C20.F2 C20.J2 C20.K1 C20.L2 C20.N1 C20.N2 C20.R1 C20.R2 C20.T1 C20.U2 D16.A1 D16.C1 D16.C2 D16.F1 D16.F2 D16.J2 D16.K1 D16.L2 D16.N1 D16.N2 D16.R1 D16.R2 D16.T1 D16.U2 D17.A1 D17.C1 D17.C2 D17.F1 D17.F2 D17.J2 D17.K1 D17.L2 D17.N1 D17.N2 D17.R1 D17.R2 D17.T1 D17.U2 D18.A1 D18.C1 D18.C2 D18.F1 D18.F2 D18.J2 D18.K1 D18.L2 D18.N1 D18.N2 D18.R1 D18.R2 D18.T1 D18.U2 D19.A1 D19.C1 D19.C2 D19.F1 D19.F2 D19.J2 D19.K1 D19.L2 D19.N1 D19.N2 D19.R1 D19.R2 D19.T1 D19.U2 D20.A1 D20.C1 D20.C2 D20.F1 D20.F2 D20.J2 D20.K1 D20.L2 D20.N1 D20.N2 D20.R1 D20.R2 D20.T1 D20.U2
VCC: AB17.AA2(VCC) AB17.BA2(VCC) AB18.AA2(VCC) AB18.BA2(VCC) AB19.AA2(VCC) AB19.BA2(VCC) AB20.AA2(VCC) AB20.BA2(VCC)

## Library data of the parts
AB17-AB20 = dec-m:M7102: Positive I/O Bus Converter
C16-C20 D16-D20 = dec-m:M903: Two-sided Posibus cable/connector.